# Altium project MiniPC.PrjPcb (part 6 of 10)

## Sheet PCIE_Connector.SchDoc: PCI Express GEN3  X 8 Connector
size B; DocumentNumber: 11; SheetNumber: 11; SheetTotal: 46
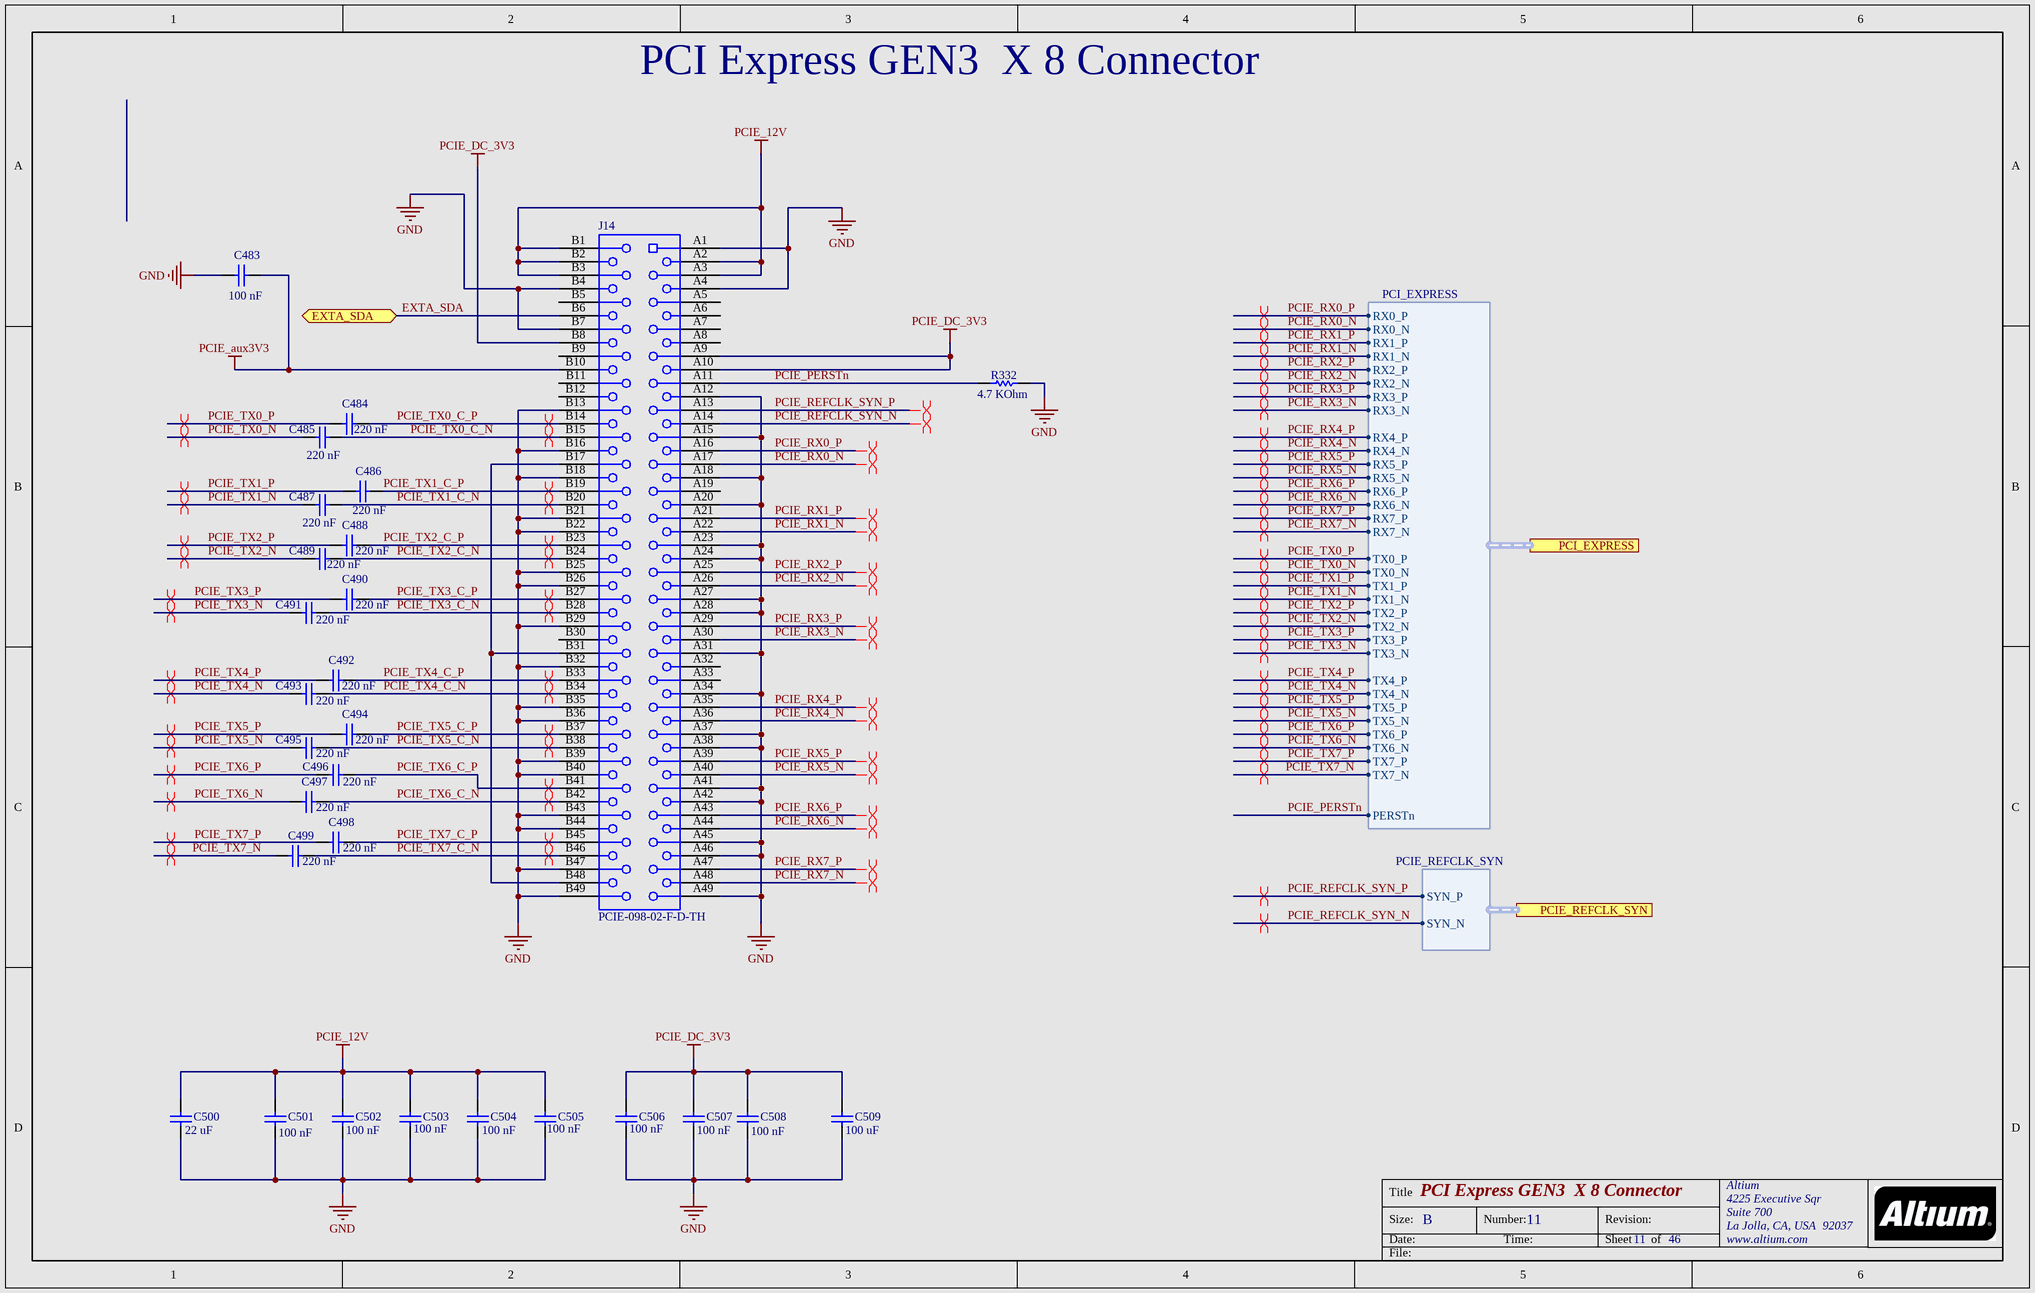
[diagram p18: PCIE_Connector.SchDoc]

### Parts
C483  Capacitance: 100 nF  [CAPC1005X55X10LL05]  (hidden comment: C1005X7R1E104M)
C484  Capacitance: 220 nF  [CAPC1005X55X25NL05T10]  (hidden comment: GRM155R61A224KE19D)
C485  Capacitance: 220 nF  [CAPC1005X55X25NL05T10]  (hidden comment: GRM155R61A224KE19D)
C486  Capacitance: 220 nF  [CAPC1005X55X25NL05T10]  (hidden comment: GRM155R61A224KE19D)
C487  Capacitance: 220 nF  [CAPC1005X55X25NL05T10]  (hidden comment: GRM155R61A224KE19D)
C488  Capacitance: 220 nF  [CAPC1005X55X25NL05T10]  (hidden comment: GRM155R61A224KE19D)
C489  Capacitance: 220 nF  [CAPC1005X55X25NL05T10]  (hidden comment: GRM155R61A224KE19D)
C490  Capacitance: 220 nF  [CAPC1005X55X25NL05T10]  (hidden comment: GRM155R61A224KE19D)
C491  Capacitance: 220 nF  [CAPC1005X55X25NL05T10]  (hidden comment: GRM155R61A224KE19D)
C492  Capacitance: 220 nF  [CAPC1005X55X25NL05T10]  (hidden comment: GRM155R61A224KE19D)
C493  Capacitance: 220 nF  [CAPC1005X55X25NL05T10]  (hidden comment: GRM155R61A224KE19D)
C494  Capacitance: 220 nF  [CAPC1005X55X25NL05T10]  (hidden comment: GRM155R61A224KE19D)
C495  Capacitance: 220 nF  [CAPC1005X55X25NL05T10]  (hidden comment: GRM155R61A224KE19D)
C496  Capacitance: 220 nF  [CAPC1005X55X25NL05T10]  (hidden comment: GRM155R61A224KE19D)
C497  Capacitance: 220 nF  [CAPC1005X55X25NL05T10]  (hidden comment: GRM155R61A224KE19D)
C498  Capacitance: 220 nF  [CAPC1005X55X25NL05T10]  (hidden comment: GRM155R61A224KE19D)
C499  Capacitance: 220 nF  [CAPC1005X55X25NL05T10]  (hidden comment: GRM155R61A224KE19D)
C500  Capacitance: 22 uF  [CAPC3216X180X55ML20T25]  (hidden comment: GRM31CR61E226KE15L)
C501  Capacitance: 100 nF  [CAPC1005X55X10LL05]  (hidden comment: C1005X7R1E104M)
C502  Capacitance: 100 nF  [CAPC1005X55X10LL05]  (hidden comment: C1005X7R1E104M)
C503  Capacitance: 100 nF  [CAPC1005X55X10LL05]  (hidden comment: C1005X7R1E104M)
C504  Capacitance: 100 nF  [CAPC1005X55X10LL05]  (hidden comment: C1005X7R1E104M)
C505  Capacitance: 100 nF  [CAPC1005X55X10LL05]  (hidden comment: C1005X7R1E104M)
C506  Capacitance: 100 nF  [CAPC1005X55X10LL05]  (hidden comment: C1005X7R1E104M)
C507  Capacitance: 100 nF  [CAPC1005X55X10LL05]  (hidden comment: C1005X7R1E104M)
C508  Capacitance: 100 nF  [CAPC1005X55X10LL05]  (hidden comment: C1005X7R1E104M)
C509  Capacitance: 100 uF  [CAPC3216X190X55ML30T25]  (hidden comment: GRM31CR60J107ME39L)
J14  PCIE-098-02-F-D-TH  [SMTC-PCIE-098-02-F-D-TH_V]
R332  Resistance: 4.7 KOhm  [RESC1005X40X25LL05T05]  (hidden comment: ERJ-2RKF4701X)

### Ports
EXTA_SDA (bidir), PCI_EXPRESS (harness PCI_EXPRESS), PCIE_REFCLK_SYN (harness PCIE_REFCLK_SYN)

### Harnesses
PCI_EXPRESS: RX0_P, RX0_N, RX1_P, RX1_N, RX2_P, RX2_N, RX3_P, RX3_N, RX7_N, RX7_P, RX4_P, RX4_N, RX5_P, RX5_N, RX6_P, RX6_N, TX0_P, TX0_N, TX1_P, TX1_N, TX2_P, TX2_N, TX3_P, TX3_N, TX7_N, TX7_P, TX4_P, TX4_N, TX5_P, TX5_N, TX6_P, TX6_N, PERSTn
PCIE_REFCLK_SYN: SYN_P, SYN_N

### Nets
GND: C483.1 C500.1 C501.1 C502.1 C503.1 C504.1 C505.1 C506.1 C507.1 C508.1 C509.1 J14.A1 J14.A4 J14.A12 J14.A15 J14.A18 J14.A20 J14.A23 J14.A24 J14.A27 J14.A28 J14.A31 J14.A34 J14.A37 J14.A38 J14.A41 J14.A42 J14.A45 J14.A46 J14.A49 J14.B4 J14.B7 J14.B13 J14.B16 J14.B18 J14.B21 J14.B22 J14.B25 J14.B26 J14.B29 J14.B32 J14.B35 J14.B36 J14.B39 J14.B40 J14.B43 J14.B44 J14.B47 J14.B49 R332.2
PCIE_12V: C500.2 C501.2 C502.2 C503.2 C504.2 C505.2 J14.A2 J14.A3 J14.B1 J14.B2 J14.B3
PCIE_aux3V3: C483.2 J14.B10
PCIE_DC_3V3: C506.2 C507.2 C508.2 C509.2 J14.A9 J14.A10 J14.B8
EXTA_SDA: J14.B6 ; port EXTA_SDA
PCIE_PERSTn: J14.A11 R332.1 ; port PCI_EXPRESS.PERSTn
PCIE_REFCLK_SYN_N: J14.A14 ; port PCIE_REFCLK_SYN.SYN_N
PCIE_REFCLK_SYN_P: J14.A13 ; port PCIE_REFCLK_SYN.SYN_P
PCIE_RX0_N: J14.A17 ; port PCI_EXPRESS.RX0_N
PCIE_RX0_P: J14.A16 ; port PCI_EXPRESS.RX0_P
PCIE_RX1_N: J14.A22 ; port PCI_EXPRESS.RX1_N
PCIE_RX1_P: J14.A21 ; port PCI_EXPRESS.RX1_P
PCIE_RX2_N: J14.A26 ; port PCI_EXPRESS.RX2_N
PCIE_RX2_P: J14.A25 ; port PCI_EXPRESS.RX2_P
PCIE_RX3_N: J14.A30 ; port PCI_EXPRESS.RX3_N
PCIE_RX3_P: J14.A29 ; port PCI_EXPRESS.RX3_P
PCIE_RX4_N: J14.A36 ; port PCI_EXPRESS.RX4_N
PCIE_RX4_P: J14.A35 ; port PCI_EXPRESS.RX4_P
PCIE_RX5_N: J14.A40 ; port PCI_EXPRESS.RX5_N
PCIE_RX5_P: J14.A39 ; port PCI_EXPRESS.RX5_P
PCIE_RX6_N: J14.A44 ; port PCI_EXPRESS.RX6_N
PCIE_RX6_P: J14.A43 ; port PCI_EXPRESS.RX6_P
PCIE_RX7_N: J14.A48 ; port PCI_EXPRESS.RX7_N
PCIE_RX7_P: J14.A47 ; port PCI_EXPRESS.RX7_P
PCIE_TX0_C_N: C485.2 J14.B15
PCIE_TX0_C_P: C484.2 J14.B14
PCIE_TX0_N: C485.1 ; port PCI_EXPRESS.TX0_N
PCIE_TX0_P: C484.1 ; port PCI_EXPRESS.TX0_P
PCIE_TX1_C_N: C487.2 J14.B20
PCIE_TX1_C_P: C486.2 J14.B19
PCIE_TX1_N: C487.1 ; port PCI_EXPRESS.TX1_N
PCIE_TX1_P: C486.1 ; port PCI_EXPRESS.TX1_P
PCIE_TX2_C_N: C489.2 J14.B24
PCIE_TX2_C_P: C488.2 J14.B23
PCIE_TX2_N: C489.1 ; port PCI_EXPRESS.TX2_N
PCIE_TX2_P: C488.1 ; port PCI_EXPRESS.TX2_P
PCIE_TX3_C_N: C491.2 J14.B28
PCIE_TX3_C_P: C490.2 J14.B27
PCIE_TX3_N: C491.1 ; port PCI_EXPRESS.TX3_N
PCIE_TX3_P: C490.1 ; port PCI_EXPRESS.TX3_P
PCIE_TX4_C_N: C493.2 J14.B34
PCIE_TX4_C_P: C492.2 J14.B33
PCIE_TX4_N: C493.1 ; port PCI_EXPRESS.TX4_N
PCIE_TX4_P: C492.1 ; port PCI_EXPRESS.TX4_P
PCIE_TX5_C_N: C495.2 J14.B38
PCIE_TX5_C_P: C494.2 J14.B37
PCIE_TX5_N: C495.1 ; port PCI_EXPRESS.TX5_N
PCIE_TX5_P: C494.1 ; port PCI_EXPRESS.TX5_P
PCIE_TX6_C_N: C497.2 J14.B42
PCIE_TX6_C_P: C496.2 J14.B41
PCIE_TX6_N: C497.1 ; port PCI_EXPRESS.TX6_N
PCIE_TX6_P: C496.1 ; port PCI_EXPRESS.TX6_P
PCIE_TX7_C_N: C499.2 J14.B46
PCIE_TX7_C_P: C498.2 J14.B45
PCIE_TX7_N: C499.1 ; port PCI_EXPRESS.TX7_N
PCIE_TX7_P: C498.1 ; port PCI_EXPRESS.TX7_P
NetJ14_B17: J14.B17 J14.B31 J14.B48

Not connected (* = marked no-connect by the designer): J14 A5 A6 A7 A8 A19 A32 A33 B5 B9 B11 B12 B30

### Layout directives
differential pair: PCIE_REFCLK_SYN_N, PCIE_REFCLK_SYN_P, PCIE_RX0_N, PCIE_RX0_P, PCIE_RX1_N, PCIE_RX1_P, PCIE_RX2_N, PCIE_RX2_P, PCIE_RX3_N, PCIE_RX3_P, PCIE_RX4_N, PCIE_RX4_P, PCIE_RX5_N, PCIE_RX5_P, PCIE_RX6_N, PCIE_RX6_P, PCIE_RX7_N, PCIE_RX7_P, PCIE_TX0_C_N, PCIE_TX0_C_P, PCIE_TX0_N, PCIE_TX0_P, PCIE_TX1_C_N, PCIE_TX1_C_P, PCIE_TX1_N, PCIE_TX1_P, PCIE_TX2_C_N, PCIE_TX2_C_P, PCIE_TX2_N, PCIE_TX2_P, PCIE_TX3_C_N, PCIE_TX3_C_P, PCIE_TX3_N, PCIE_TX3_P, PCIE_TX4_C_N, PCIE_TX4_C_P, PCIE_TX4_N, PCIE_TX4_P, PCIE_TX5_C_N, PCIE_TX5_C_P, PCIE_TX5_N, PCIE_TX5_P, PCIE_TX6_C_N, PCIE_TX6_C_P, PCIE_TX6_N, PCIE_TX6_P, PCIE_TX7_C_N, PCIE_TX7_C_P, PCIE_TX7_N, PCIE_TX7_P

### Notes on the sheet
- Title
- Size:
- Date:
- B
- Number:
- Time:
- Revision:
- Sheet
- of
- File:

### Library data of the parts
C483 C501-C508 = CMP-1663-00009-2: Chip Capacitor, 0.1 uF, +/- 20%, 25 V, -55 to 125 degC, 0402 (1005 Metric), RoHS, Tape and Reel; Type (Capacitors): X7R; Voltage Rating: 25 V; Case\/Package: 0402; Tolerance: 20%; Max Operating Temperature: 125 degC; ComponentLink2URL: http://www.farnell.com/datasheets/1571323.pdf; ComponentLink1URL: http://www.tdk.com/; RoHSCompliant: true; Packaging: Tape and Reel; Mounting Technology: Surface Mount; ComponentLink2Description: Datasheet; Case Code (Imperial): 0402; DatasheetVersion: 09/2011; ComponentLink1Description: Manufacturer URL; PackageDescription: 2-Pin Surface Mount Device, Body 1 x 0.5 mm; PackageReference: 0402; Min Operating Temperature: -55 degC; Case Code (Metric): 1005; Height: 0.5 mm; Package Quantity: 10000; Width: 0.5 mm; Pins: 2; Voltage Rating (DC): 25 V; PartNumber: C1005X7R1E104M; Mount: Surface Mount; Length: 1 mm
C484-C499 = CMP-2008-04561-4: Chip Capacitor, 220 nF, +/- 10%, 10 V, -55 to 85 degC, 0402 (1005 Metric), RoHS, Tape and Reel; Manufacturer: Basic Passives; Voltage Rating: 10 V; Case\/Package: 0402; Type (Capacitors): X5R; ComponentLink1URL: http://www.murata.com/; Package Quantity: 1; Tolerance: 10%; Mounting Technology: Surface Mount; RoHSCompliant: true; PartNumber: GRM155R61A224KE19D; Max Operating Temperature: 85 degC; Case Code (Imperial): 0402; Length: 1 mm; Packaging: Tape and Reel; Min Operating Temperature: -55 degC; PackageDescription: 2-Pin Surface Mount Device, Body 1 x 0.5 mm; Height: 0.5 mm; Case Code (Metric): 1005; REACH SVHC: No SVHC; ComponentLink1Description: Manufacturer URL; Width: 0.5 mm; ComponentLink2URL: http://search.murata.co.jp/Ceramy/image/img/A01X/G101/ENG/GRM155R61A224KE19-01.pdf; Radiation Hardening: No; Pins: 2; Voltage Rating (DC): 10 V; DatasheetVersion: 03/2016; Mount: Surface Mount; PackageReference: 0402; ComponentLink2Description: Datasheet
C500 = CMP-1662-00010-2: Chip Capacitor, 22 uF, +/- 10%, 25 V, -55 to 85 degC, 1206 (3216 Metric), RoHS, Tape and Reel; Voltage Rating (DC): 25 V; Case\/Package: 1206; Type (Capacitors): X5R; Tolerance: 10%; Max Operating Temperature: 85 degC; Package Quantity: 2000; Voltage Rating: 25 V; Case Code (Metric): 3216; Length: 3.2 mm; PackageDescription: 2-Pin Surface Mount Device, Body 3.2 x 1.6 mm; ComponentLink1Description: Manufacturer URL; Case Code (Imperial): 1206; ComponentLink1URL: http://www.murata.com/; Radiation Hardening: No; Height: 1.6 mm; Width: 1.6 mm; DatasheetVersion: 03/2016; Min Operating Temperature: -55 degC; Mount: Surface Mount; REACH SVHC: No SVHC; PackageReference: 1206; ComponentLink2URL: http://search.murata.co.jp/Ceramy/image/img/A01X/G101/ENG/GRM31CR61E226KE15-01.pdf; Packaging: Tape and Reel; RoHSCompliant: true; ComponentLink2Description: Datasheet; Mounting Technology: Surface Mount; PartNumber: GRM31CR61E226KE15L; Pins: 2
C509 = CMP-1662-00011-2: Chip Capacitor, 100 uF, +/- 20%, 6.3 V, -55 to 85 degC, 1206 (3216 Metric), RoHS, Tape and Reel; Voltage Rating: 6.3 V; Type (Capacitors): X5R; Case\/Package: 1206; Tolerance: 20%; ComponentLink1URL: http://www.murata.com/; ComponentLink1Description: Manufacturer URL; PackageDescription: 2-Pin Surface Mount Device, Body 3.2 x 1.6 mm; Max Operating Temperature: 85 degC; Case Code (Imperial): 1206; PackageReference: 1206; Height: 1.6 mm; Width: 1.6 mm; Packaging: Tape and Reel; DatasheetVersion: 09/2016; REACH SVHC: No SVHC; Mounting Technology: Surface Mount; Case Code (Metric): 3216; Min Operating Temperature: -55 degC; RoHSCompliant: true; Radiation Hardening: No; Voltage Rating (DC): 6.3 V; Package Quantity: 2000; ComponentLink2Description: Datasheet; Mount: Surface Mount; Length: 3.2 mm; ComponentLink2URL: http://psearch.en.murata.com/capacitor/product/GRM31CR60J107ME39%23.pdf; Pins: 2; PartNumber: GRM31CR60J107ME39L
J14 = CMP-1707-00002-1: Female Header, Pitch 1 mm, 98 Positions, 4 Rows, Height 11 mm, Tail Length 2.31 mm, -55 to 125 degC, RoHS; Manufacturer: Samtec; PartNumber: PCIE-098-02-F-D-TH; PackageReference: PCIE-098-02-F-D-TH; ComponentLink3URL: http://suddendocs.samtec.com/prints/pcie-xxx-02-x-d-th-footprint.pdf; PackageDescription: Female Header, Pitch 1 mm, 98 Positions, 4 Rows, Height 11 mm, Tail Length 2.31 mm; ComponentLink2Description: Datasheet; ComponentLink1URL: http://www.samtec.com/; Mounting Technology: Through Hole; DatasheetVersion: Rev. 21JAN16; ComponentLink2URL: http://suddendocs.samtec.com/catalog_english/pcie.pdf; ComponentLink1Description: Manufacturer URL; ComponentLink3Description: Package Specification
R332 = CMP-1665-00031-3: Chip Resistor, 4.7 KOhm, +/- 1%, 0.1 W, -55 to 155 degC, 0402 (1005 Metric), RoHS, Tape and Reel; Voltage Rating: 50 V; Case\/Package: 0402; Power Rating: 100 mW; Tolerance: 1%; Case Code (Imperial): 0402; PartNumber: ERJ-2RKF4701X; Mounting Technology: Surface Mount; ComponentLink1Description: Manufacturer URL; Width: 0.5 mm; DatasheetVersion: 04/2015; PackageDescription: 2-Pin Surface Mount Device, Body 1 x 0.5 mm; ComponentLink2Description: Datasheet; Packaging: Cut Tape; RoHSCompliant: true; Package Quantity: 1; Height: 0.35 mm; REACH SVHC: Yes; Case Code (Metric): 1005; Max Operating Temperature: 155 degC; ComponentLink1URL: http://www.panasonic.com/; Radiation Hardening: No; ComponentLink2URL: http://industrial.panasonic.com/cdbs/www-data/pdf/RDA0000/AOA0000C86.pdf; Min Operating Temperature: -55 degC; Length: 1 mm; Pins: 2; PackageReference: 0402; Mount: Surface Mount

## Sheet PLL1.SchDoc: PLL
size B; DocumentNumber: 13; SheetNumber: 13; SheetTotal: 46
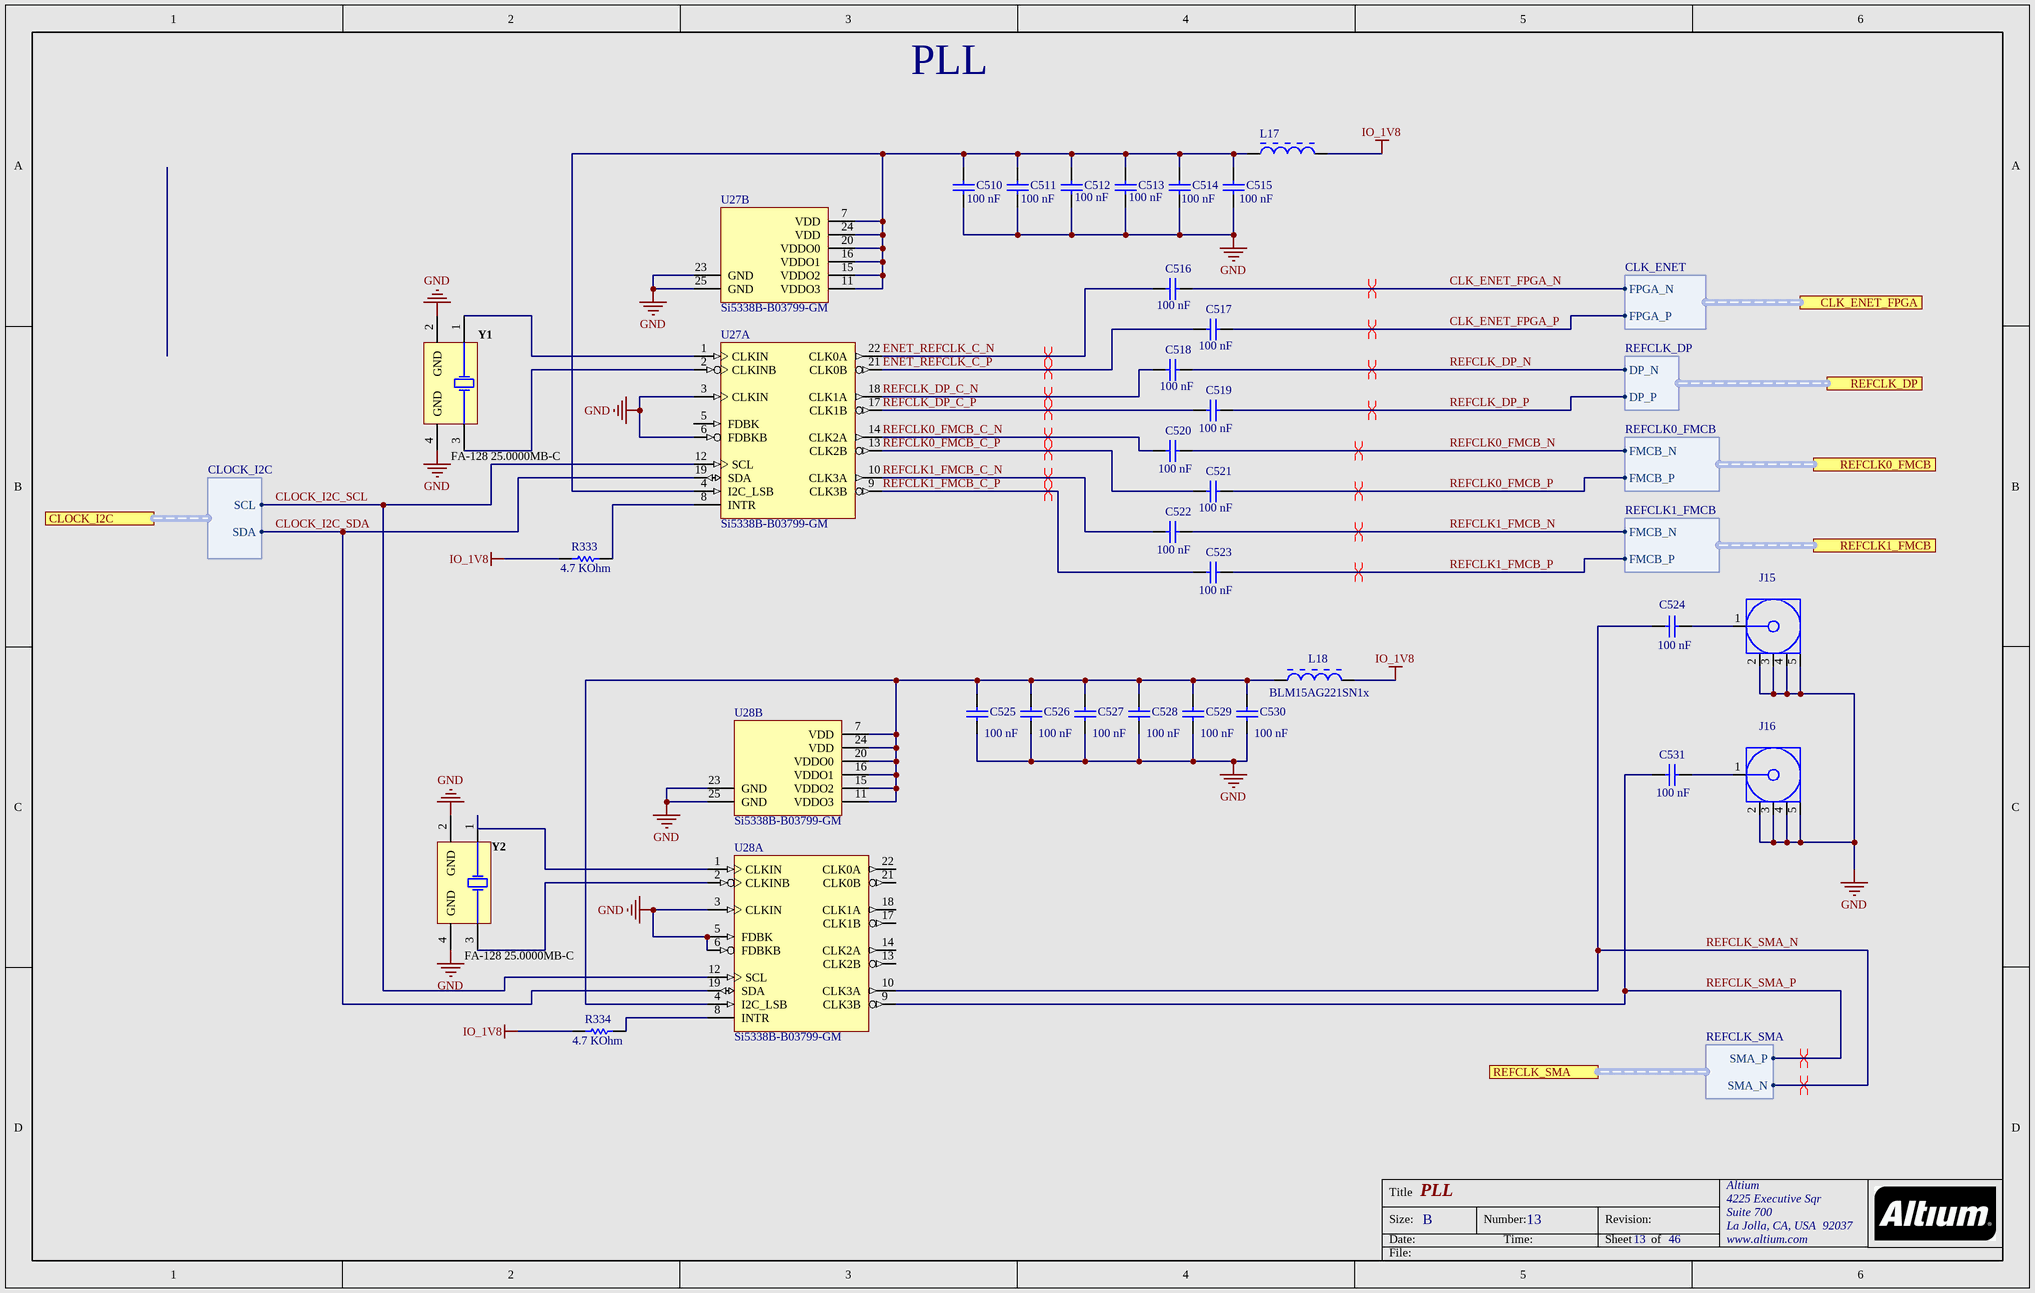
[diagram p19: PLL1.SchDoc]

### Parts
C510  Capacitance: 100 nF  [CAPC1005X55X10LL05]  (hidden comment: C1005X7R1E104M)
C511  Capacitance: 100 nF  [CAPC1005X55X10LL05]  (hidden comment: C1005X7R1E104M)
C512  Capacitance: 100 nF  [CAPC1005X55X10LL05]  (hidden comment: C1005X7R1E104M)
C513  Capacitance: 100 nF  [CAPC1005X55X10LL05]  (hidden comment: C1005X7R1E104M)
C514  Capacitance: 100 nF  [CAPC1005X55X10LL05]  (hidden comment: C1005X7R1E104M)
C515  Capacitance: 100 nF  [CAPC1005X55X10LL05]  (hidden comment: C1005X7R1E104M)
C516  Capacitance: 100 nF  [CAPC1005X55X10LL05]  (hidden comment: C1005X7R1E104M)
C517  Capacitance: 100 nF  [CAPC1005X55X10LL05]  (hidden comment: C1005X7R1E104M)
C518  Capacitance: 100 nF  [CAPC1005X55X10LL05]  (hidden comment: C1005X7R1E104M)
C519  Capacitance: 100 nF  [CAPC1005X55X10LL05]  (hidden comment: C1005X7R1E104M)
C520  Capacitance: 100 nF  [CAPC1005X55X10LL05]  (hidden comment: C1005X7R1E104M)
C521  Capacitance: 100 nF  [CAPC1005X55X10LL05]  (hidden comment: C1005X7R1E104M)
C522  Capacitance: 100 nF  [CAPC1005X55X10LL05]  (hidden comment: C1005X7R1E104M)
C523  Capacitance: 100 nF  [CAPC1005X55X10LL05]  (hidden comment: C1005X7R1E104M)
C524  Capacitance: 100 nF  [CAPC1005X55X10LL05]  (hidden comment: C1005X7R1E104M)
C525  Capacitance: 100 nF  [CAPC1005X55X10LL05]  (hidden comment: C1005X7R1E104M)
C526  Capacitance: 100 nF  [CAPC1005X55X10LL05]  (hidden comment: C1005X7R1E104M)
C527  Capacitance: 100 nF  [CAPC1005X55X10LL05]  (hidden comment: C1005X7R1E104M)
C528  Capacitance: 100 nF  [CAPC1005X55X10LL05]  (hidden comment: C1005X7R1E104M)
C529  Capacitance: 100 nF  [CAPC1005X55X10LL05]  (hidden comment: C1005X7R1E104M)
C530  Capacitance: 100 nF  [CAPC1005X55X10LL05]  (hidden comment: C1005X7R1E104M)
C531  Capacitance: 100 nF  [CAPC1005X55X10LL05]  (hidden comment: C1005X7R1E104M)
J15  LTI-SASF54GT  [LHT-LTI-SASF54GT_V]  (value not drawn)
J16  LTI-SASF54GT  [LHT-LTI-SASF54GT_V]  (value not drawn)
L17  BLM15AG221SN1J  [MURA-BLM15-CHIP-2_V]  (value not drawn)
L18  BLM15AG221SN1x  [MURA-BLM15AG221SN1x_V]
R333  Resistance: 4.7 KOhm  [RESC1005X40X25LL05T05]  (hidden comment: ERJ-2RKF4701X)
R334  Resistance: 4.7 KOhm  [RESC1005X40X25LL05T05]  (hidden comment: ERJ-2RKF4701X)
U27  Si5338B-B03799-GM  [SLAB-QFN-24-2550x2550TP_V]  (parts A,B of 2)
U28  Si5338B-B03799-GM  [SLAB-QFN-24-2550x2550TP_V]  (parts A,B of 2)
Y1  FA-128 25.0000MB-C  [EPSON-FA-128_V]
Y2  FA-128 25.0000MB-C  [EPSON-FA-128_V]

### Ports
CLK_ENET_FPGA (harness CLK_ENET), CLOCK_I2C (harness CLOCK_I2C), REFCLK0_FMCB (harness REFCLK0_FMCB), REFCLK1_FMCB (harness REFCLK1_FMCB), REFCLK_DP (harness REFCLK_DP), REFCLK_SMA (harness REFCLK_SMA)

### Harnesses
REFCLK0_FMCB: FMCB_N, FMCB_P
CLK_ENET: FPGA_N, FPGA_P
REFCLK1_FMCB: FMCB_N, FMCB_P
REFCLK_SMA: SMA_P, SMA_N
REFCLK_DP: DP_N, DP_P
CLOCK_I2C: SCL, SDA

### Nets
GND: C510.2 C511.2 C512.2 C513.2 C514.2 C515.2 C525.2 C526.2 C527.2 C528.2 C529.2 C530.2 J15.2 J15.3 J15.4 J15.5 J16.2 J16.3 J16.4 J16.5 U27.3(CLKIN) U27.6(FDBKB) U27.23(GND) U27.25(GND) U28.3(CLKIN) U28.5(FDBK) U28.6(FDBKB) U28.23(GND) U28.25(GND) Y1.2(GND) Y1.4(GND) Y2.2(GND) Y2.4(GND)
IO_1V8: L17.2 L18.2 R333.1 R334.1
CLK_ENET_FPGA_N: C516.2 ; port CLK_ENET_FPGA.FPGA_N
CLK_ENET_FPGA_P: C517.2 ; port CLK_ENET_FPGA.FPGA_P
CLOCK_I2C_SCL: U27.12(SCL) U28.12(SCL) ; port CLOCK_I2C.SCL
CLOCK_I2C_SDA: U27.19(SDA) U28.19(SDA) ; port CLOCK_I2C.SDA
ENET_REFCLK_C_N: C516.1 U27.22(CLK0A)
ENET_REFCLK_C_P: C517.1 U27.21(CLK0B)
REFCLK0_FMCB_C_N: C520.1 U27.14(CLK2A)
REFCLK0_FMCB_C_P: C521.1 U27.13(CLK2B)
REFCLK0_FMCB_N: C520.2 ; port REFCLK0_FMCB.FMCB_N
REFCLK0_FMCB_P: C521.2 ; port REFCLK0_FMCB.FMCB_P
REFCLK1_FMCB_C_N: C522.1 U27.10(CLK3A)
REFCLK1_FMCB_C_P: C523.1 U27.9(CLK3B)
REFCLK1_FMCB_N: C522.2 ; port REFCLK1_FMCB.FMCB_N
REFCLK1_FMCB_P: C523.2 ; port REFCLK1_FMCB.FMCB_P
REFCLK_DP_C_N: C518.1 U27.18(CLK1A)
REFCLK_DP_C_P: C519.1 U27.17(CLK1B)
REFCLK_DP_N: C518.2 ; port REFCLK_DP.DP_N
REFCLK_DP_P: C519.2 ; port REFCLK_DP.DP_P
REFCLK_SMA_N: C524.1 U28.10(CLK3A) ; port REFCLK_SMA.SMA_N
REFCLK_SMA_P: C531.1 U28.9(CLK3B) ; port REFCLK_SMA.SMA_P
NetC510_1: C510.1 C511.1 C512.1 C513.1 C514.1 C515.1 L17.1 U27.4(I2C_LSB) U27.7(VDD) U27.11(VDDO3) U27.15(VDDO2) U27.16(VDDO1) U27.20(VDDO0) U27.24(VDD)
NetC524_2: C524.2 J15.1
NetC525_1: C525.1 C526.1 C527.1 C528.1 C529.1 C530.1 L18.1 U28.4(I2C_LSB) U28.7(VDD) U28.11(VDDO3) U28.15(VDDO2) U28.16(VDDO1) U28.20(VDDO0) U28.24(VDD)
NetC531_2: C531.2 J16.1
NetR333_2: R333.2 U27.8(INTR)
NetR334_2: R334.2 U28.8(INTR)
NetU27_1: U27.1(CLKIN) Y1.1(X1)
NetU27_2: U27.2(CLKINB) Y1.3(X2)
NetU28_1: U28.1(CLKIN) Y2.1(X1)
NetU28_2: U28.2(CLKINB) Y2.3(X2)

Not connected (* = marked no-connect by the designer): U27 5(FDBK); U28 13(CLK2B) 14(CLK2A) 17(CLK1B) 18(CLK1A) 21(CLK0B) 22(CLK0A)

### Layout directives
differential pair: CLK_ENET_FPGA_N, CLK_ENET_FPGA_P, ENET_REFCLK_C_N, ENET_REFCLK_C_P, REFCLK0_FMCB_C_N, REFCLK0_FMCB_C_P, REFCLK0_FMCB_N, REFCLK0_FMCB_P, REFCLK1_FMCB_C_N, REFCLK1_FMCB_C_P, REFCLK1_FMCB_N, REFCLK1_FMCB_P, REFCLK_DP_C_N, REFCLK_DP_C_P, REFCLK_DP_N, REFCLK_DP_P, REFCLK_SMA_N, REFCLK_SMA_P

### Notes on the sheet
- Title
- Size:
- Date:
- B
- Number:
- Time:
- Revision:
- Sheet
- of
- File:

### Library data of the parts
C510-C531 = CMP-1663-00009-2: as C483 on sheet PCIE_Connector; Tolerance: 20%; Mounting Technology: Surface Mount; Max Operating Temperature: 125 degC; ComponentLink2URL: http://www.farnell.com/datasheets/1571323.pdf; ComponentLink1URL: http://www.tdk.com/; RoHSCompliant: true; Packaging: Tape and Reel; ComponentLink2Description: Datasheet; Case Code (Imperial): 0402; DatasheetVersion: 09/2011; ComponentLink1Description: Manufacturer URL; PackageDescription: 2-Pin Surface Mount Device, Body 1 x 0.5 mm; PackageReference: 0402; Min Operating Temperature: -55 degC; Case Code (Metric): 1005; Height: 0.5 mm; Package Quantity: 10000; Width: 0.5 mm; Pins: 2; Voltage Rating (DC): 25 V; PartNumber: C1005X7R1E104M; Mount: Surface Mount; Length: 1 mm
J15 J16 = CMP-1713-00001-1: SMA Connector, Pitch 2.54 mm, 1 Position, Height 9.5 mm, Tail Length 4 mm, RoHS; Manufacturer: Lighthorse Technologies Inc.; ComponentLink2Description: Datasheet; Mounting Technology: Through Hole; ComponentLink1Description: Manufacturer URL; PackageDescription: SMA Connector, Pitch 2.54 mm, 1 Position, Height 9.5 mm, Tail Length 4 mm; PartNumber: LTI-SASF54GT; PackageReference: LTI-SASF54GT; DatasheetVersion: Rev. May-99; ComponentLink2URL: http://rfconnector.com/sheets/SASF54GT.pdf; ComponentLink1URL: http://www.rfconnector.com
L17 = CMP-0686-00186-2: Chip Ferrite Bead for General Use, 220 Ohm, 450 mA, -55 to 125 degC, 1 x 0.5 x 0.55 mm SMD, Tape and Reel; Manufacturer: Murata; DC Resistance: 0.29 Ohm Max.; Rated Current: 450 mA; Impedance (at 100 MHz): 220 Ohm +/- 25%; DatasheetVersion: 08/2013; ComponentLink2URL: http://www.murata.com/products/catalog/pdf/c31e.pdf; PackageDescription: 2-Pin Chip, Body 1 x 0.5 mm; ComponentLink3Description: Package Specification; Packing: Tape and Reel; Operating Temperature Range: -55 to 125 degC; ComponentLink3URL: http://www.murata.com/products/catalog/pdf/c31e.pdf; Mounting Technology: Surface Mount; PartNumber: BLM15AG221SN1J; ComponentLink2Description: Datasheet; ComponentLink1Description: Manufacturer URL; PackageReference: BLM15-2; ComponentLink1URL: http://www.murata.com/
L18 = CMP-1662-00018-3: Chip Bead, 220 Ohm, +/- 25 %, 100 MHz, 300 mA, -55 to 125 degC, 0402 (1005 Metric), RoHS; Current Rating: 200 mA; Max Current Rating: 450 mA; Resistance: 220 Ohm; Tolerance: 25%; PartNumber: BLM15AG221SN1x; ComponentLink1Description: Manufacturer URL; Max Operating Temperature: 125 degC; Length: 1 mm; Width: 0.5 mm; REACH SVHC: No SVHC; Height: 0.5 mm; DatasheetVersion: 03/2011; Case/Package: 0402; ComponentLink2URL: https://datasheet.ciiva.com/11800/0900766b811b5866-11800858.pdf; Min Operating Temperature: -55 degC; RoHSCompliant: True; Radiation Hardening: No; Package Quantity: 10000; Case Code (Imperial): 0402; ComponentLink1URL: http://www.murata.com/; ComponentLink2Description: Datasheet; Mounting Technology: Surface Mount; PackageDescription: 2-Pin Surface Mount Device, Body 1 x 0.5 mm; Case Code (Metric): 1005
R333 R334 = CMP-1665-00031-3: as R332 on sheet PCIE_Connector; Tolerance: 1%; Case Code (Imperial): 0402; PartNumber: ERJ-2RKF4701X; Mounting Technology: Surface Mount; ComponentLink1Description: Manufacturer URL; Width: 0.5 mm; DatasheetVersion: 04/2015; PackageDescription: 2-Pin Surface Mount Device, Body 1 x 0.5 mm; ComponentLink2Description: Datasheet; Packaging: Cut Tape; RoHSCompliant: true; Package Quantity: 1; Height: 0.35 mm; REACH SVHC: Yes; Case Code (Metric): 1005; Max Operating Temperature: 155 degC; ComponentLink1URL: http://www.panasonic.com/; Radiation Hardening: No; ComponentLink2URL: http://industrial.panasonic.com/cdbs/www-data/pdf/RDA0000/AOA0000C86.pdf; Min Operating Temperature: -55 degC; Length: 1 mm; Pins: 2; PackageReference: 0402; Mount: Surface Mount
U27 U28 = CMP-1706-00002-1: I2C-Programmable Any-Frequency, Any-Output Quad Clock Generator, 1.8 / 2.5 / 3.3 V, 0.16 to 350 MHz Output, -40 to 85 degC, 24-Pin QFN, RoHS; Manufacturer: Silicon Labs; PartNumber: Si5338B-B03799-GM; ComponentLink1Description: Manufacturer URL; ComponentLink2Description: Datasheet; ComponentLink2URL: https://www.silabs.com/Support%20Documents/TechnicalDocs/Si5338.pdf; Mounting Technology: Surface Mount; DatasheetVersion: Rev. 1.6; PackageDescription: 24-Pin Quad Flat No-lead Package, Body 4 x 4 mm, Pitch 0.5 mm; ComponentLink1URL: http://www.silabs.com/; PackageReference: QFN-24; Code_IPC: J-STD-020; PartId: 1
Y1 Y2 = CMP-1695-00001-3: Range Crystal Unit, 25 MHz, -40 to 85 degC, 4-Pin SMD, RoHS, Tape and Reel; ComponentLink2Description: Datasheet; Mounting Technology: Surface Mount; PackageDescription: 4-Pin Surface Mount Device, Body 1.6 x 2 mm, Pitch 1.45 mm; ComponentLink1URL: https://www.eea.epson.com/; DatasheetVersion: Rev. Feb-15; ComponentLink2URL: https://support.epson.biz/td/api/doc_check.php?dl=brief_FA-128_en.pdf; ComponentLink1Description: Manufacturer URL; PartNumber: FA-128 25.0000MB-C

## Sheet PLL.SchDoc: PLL
size B; DocumentNumber: 12; SheetNumber: 12; SheetTotal: 46
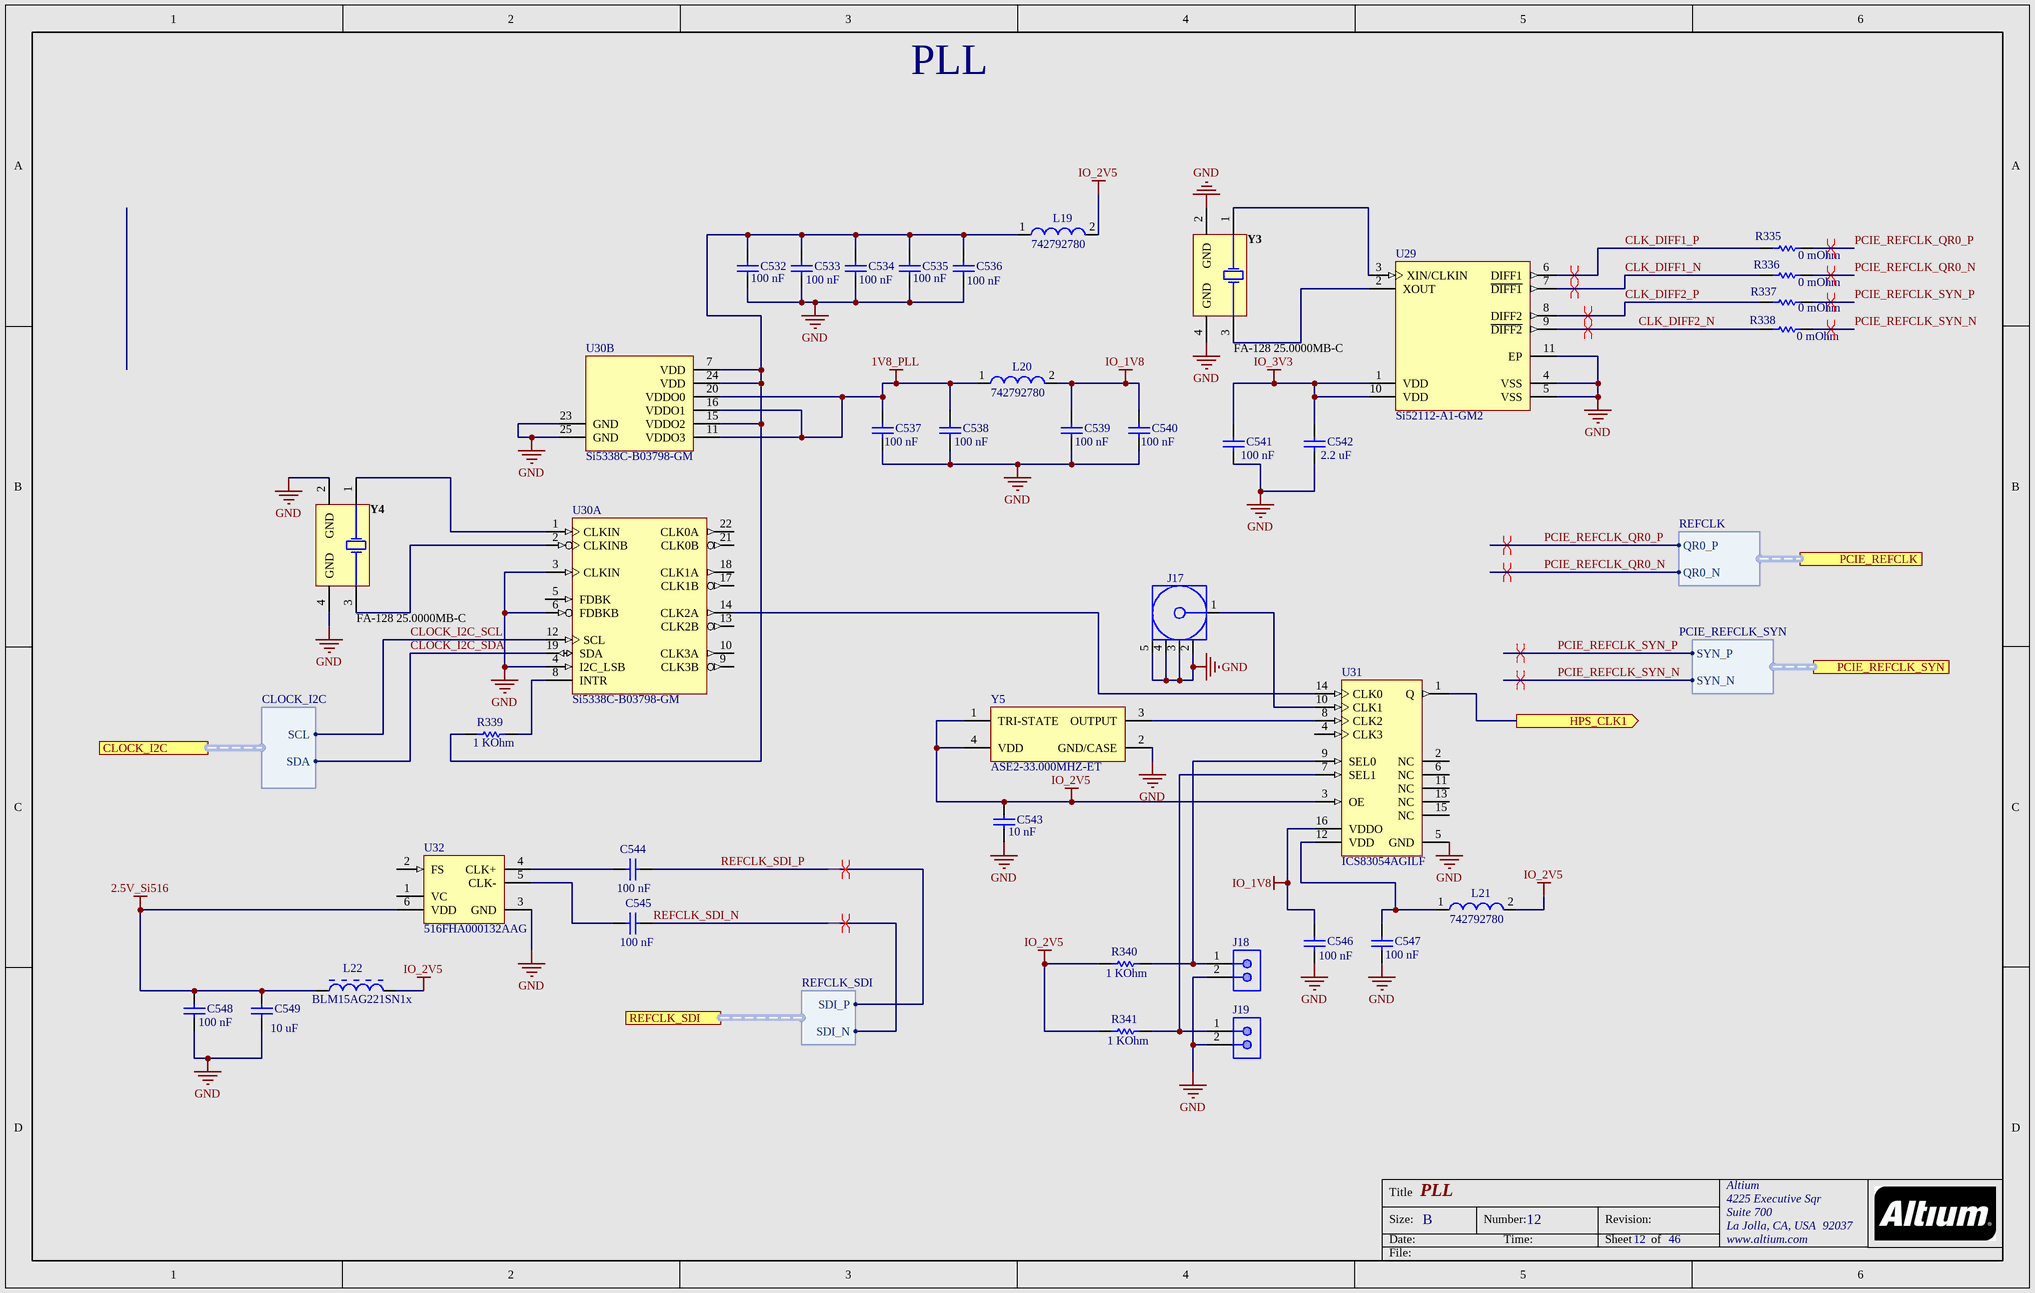
[diagram p20: PLL.SchDoc]

### Parts
C532  Capacitance: 100 nF  [CAPC1005X55X10LL05]  (hidden comment: C1005X7R1E104M)
C533  Capacitance: 100 nF  [CAPC1005X55X10LL05]  (hidden comment: C1005X7R1E104M)
C534  Capacitance: 100 nF  [CAPC1005X55X10LL05]  (hidden comment: C1005X7R1E104M)
C535  Capacitance: 100 nF  [CAPC1005X55X10LL05]  (hidden comment: C1005X7R1E104M)
C536  Capacitance: 100 nF  [CAPC1005X55X10LL05]  (hidden comment: C1005X7R1E104M)
C537  Capacitance: 100 nF  [CAPC1005X55X10LL05]  (hidden comment: C1005X7R1E104M)
C538  Capacitance: 100 nF  [CAPC1005X55X10LL05]  (hidden comment: C1005X7R1E104M)
C539  Capacitance: 100 nF  [CAPC1005X55X10LL05]  (hidden comment: C1005X7R1E104M)
C540  Capacitance: 100 nF  [CAPC1005X55X10LL05]  (hidden comment: C1005X7R1E104M)
C541  Capacitance: 100 nF  [CAPC1005X55X10LL05]  (hidden comment: C1005X7R1E104M)
C542  Capacitance: 2.2 uF  [CAPC1608X90X35ML10T15]  (hidden comment: GRM188R61A225KE34x)
C543  Capacitance: 10 nF  [CAPC1005X55X25ML05T10]  (hidden comment: GRM155R71H103KA88D)
C544  Capacitance: 100 nF  [CAPC1005X55X10LL05]  (hidden comment: C1005X7R1E104M)
C545  Capacitance: 100 nF  [CAPC1005X55X10LL05]  (hidden comment: C1005X7R1E104M)
C546  Capacitance: 100 nF  [CAPC1005X55X10LL05]  (hidden comment: C1005X7R1E104M)
C547  Capacitance: 100 nF  [CAPC1005X55X10LL05]  (hidden comment: C1005X7R1E104M)
C548  Capacitance: 100 nF  [CAPC1005X55X10LL05]  (hidden comment: C1005X7R1E104M)
C549  Capacitance: 10 uF  [CAPC2013X100X20NL20]  (hidden comment: C2012X5R1C106K085AC)
J17  LTI-SASF54GT  [LHT-LTI-SASF54GT_V]  (value not drawn)
J18  613 002 111 21  [WE-61300211121_V]  (value not drawn)
J19  613 002 111 21  [WE-61300211121_V]  (value not drawn)
L19  742792780  [SMD-0402]
L20  742792780  [SMD-0402]
L21  742792780  [SMD-0402]
L22  BLM15AG221SN1x  [MURA-BLM15AG221SN1x_V]
R335  Resistance: 0 mOhm  [RESC1005X40X25ML05T05]  (hidden comment: ERJ-2GE0R00X)
R336  Resistance: 0 mOhm  [RESC1005X40X25ML05T05]  (hidden comment: ERJ-2GE0R00X)
R337  Resistance: 0 mOhm  [RESC1005X40X25ML05T05]  (hidden comment: ERJ-2GE0R00X)
R338  Resistance: 0 mOhm  [RESC1005X40X25ML05T05]  (hidden comment: ERJ-2GE0R00X)
R339  Resistance: 1 KOhm  [RESC1005X40X25LL05T05]  (hidden comment: ERJ-2RKF1001X)
R340  Resistance: 1 KOhm  [RESC1005X40X25LL05T05]  (hidden comment: ERJ-2RKF1001X)
R341  Resistance: 1 KOhm  [RESC1005X40X25LL05T05]  (hidden comment: ERJ-2RKF1001X)
U29  Si52112-A1-GM2  [SLAB-TDFN-10_L]
U30  Si5338C-B03798-GM  [SLAB-QFN-24-2550x2550TP_V]  (parts A,B of 2)
U31  ICS83054AGILF  [IDT-TSSOP-16_M]
U32  516FHA000132AAG  [SLAB-DFN-6-5000X7000DE_A_V]
Y3  FA-128 25.0000MB-C  [EPSON-FA-128_V]
Y4  FA-128 25.0000MB-C  [EPSON-FA-128_V]
Y5  ASE2-33.000MHZ-ET  [ABRA-ASE2_V]

### Ports
CLOCK_I2C (harness CLOCK_I2C), HPS_CLK1 (out), PCIE_REFCLK (harness REFCLK), PCIE_REFCLK_SYN (harness PCIE_REFCLK_SYN), REFCLK_SDI (harness REFCLK_SDI)

### Harnesses
REFCLK: QR0_P, QR0_N
PCIE_REFCLK_SYN: SYN_N, SYN_P
REFCLK_SDI: SDI_P, SDI_N
CLOCK_I2C: SCL, SDA

### Nets
1V8_PLL: C537.2 C538.2 L20.1 U30.11(VDDO3) U30.16(VDDO1) U30.20(VDDO0)
2.5V_Si516: C548.2 C549.2 L22.1 U32.6(VDD)
GND: C532.1 C533.1 C534.1 C535.1 C536.1 C537.1 C538.1 C539.1 C540.1 C541.1 C542.1 C543.1 C546.1 C547.1 C548.1 C549.1 J17.2 J17.3 J17.4 J17.5 J18.2 J19.2 U29.4(VSS) U29.5(VSS) U29.11(EP) U30.3(CLKIN) U30.4(I2C_LSB) U30.6(FDBKB) U30.23(GND) U30.25(GND) U31.5(GND) U32.3(GND) Y3.2(GND) Y3.4(GND) Y4.2(GND) Y4.4(GND) Y5.2(GND/CASE)
IO_1V8: C539.2 C540.2 C546.2 L20.2 U31.16(VDDO)
IO_2V5: C543.2 L19.2 L21.2 L22.2 R340.1 R341.1 U31.3(OE) Y5.1(TRI-STATE) Y5.4(VDD)
IO_3V3: C541.2 C542.2 U29.1(VDD) U29.10(VDD)
CLK_DIFF1_N: R336.1 U29.7(~{DIFF1})
CLK_DIFF1_P: R335.1 U29.6(DIFF1)
CLK_DIFF2_N: R338.1 U29.9(~{DIFF2})
CLK_DIFF2_P: R337.1 U29.8(DIFF2)
CLOCK_I2C_SCL: U30.12(SCL) ; port CLOCK_I2C.SCL
CLOCK_I2C_SDA: U30.19(SDA) ; port CLOCK_I2C.SDA
HPS_CLK1: U31.1(Q) ; port HPS_CLK1
PCIE_REFCLK_QR0_N: R336.2 ; port PCIE_REFCLK.QR0_N
PCIE_REFCLK_QR0_P: R335.2 ; port PCIE_REFCLK.QR0_P
PCIE_REFCLK_SYN_N: R338.2 ; port PCIE_REFCLK_SYN.SYN_N
PCIE_REFCLK_SYN_P: R337.2 ; port PCIE_REFCLK_SYN.SYN_P
REFCLK_SDI_N: C545.1 ; port REFCLK_SDI.SDI_N
REFCLK_SDI_P: C544.1 ; port REFCLK_SDI.SDI_P
NetC532_2: C532.2 C533.2 C534.2 C535.2 C536.2 L19.1 R339.1 U30.7(VDD) U30.15(VDDO2) U30.24(VDD)
NetC544_2: C544.2 U32.4(CLK+)
NetC545_2: C545.2 U32.5(CLK-)
NetC547_2: C547.2 L21.1 U31.12(VDD)
NetJ17_1: J17.1 U31.10(CLK1)
NetJ18_1: J18.1 R340.2 U31.9(SEL0)
NetJ19_1: J19.1 R341.2 U31.7(SEL1)
NetR339_2: R339.2 U30.8(INTR)
NetU29_2: U29.2(XOUT) Y3.3(X2)
NetU29_3: U29.3(XIN/CLKIN) Y3.1(X1)
NetU30_1: U30.1(CLKIN) Y4.1(X1)
NetU30_2: U30.2(CLKINB) Y4.3(X2)
NetU30_14: U30.14(CLK2A) U31.14(CLK0)
NetU31_8: U31.8(CLK2) Y5.3(OUTPUT)

Not connected (* = marked no-connect by the designer): U30 5(FDBK) 9(CLK3B) 10(CLK3A) 13(CLK2B) 17(CLK1B) 18(CLK1A) 21(CLK0B) 22(CLK0A); U31 2(NC) 4(CLK3) 6(NC) 11(NC) 13(NC) 15(NC); U32 1(VC) 2(FS)

### Layout directives
differential pair: CLK_DIFF1_N, CLK_DIFF1_P, CLK_DIFF2_N, CLK_DIFF2_P, PCIE_REFCLK_QR0_N, PCIE_REFCLK_QR0_P, PCIE_REFCLK_SYN_N, PCIE_REFCLK_SYN_P, REFCLK_SDI_N, REFCLK_SDI_P

### Notes on the sheet
- Title
- Size:
- Date:
- B
- Number:
- Time:
- Revision:
- Sheet
- of
- File:

### Library data of the parts
C532-C541 C544-C548 = CMP-1663-00009-2: as C483 on sheet PCIE_Connector; Tolerance: 20%; Mounting Technology: Surface Mount; Max Operating Temperature: 125 degC; ComponentLink2URL: http://www.farnell.com/datasheets/1571323.pdf; ComponentLink1URL: http://www.tdk.com/; RoHSCompliant: true; Packaging: Tape and Reel; ComponentLink2Description: Datasheet; Case Code (Imperial): 0402; DatasheetVersion: 09/2011; ComponentLink1Description: Manufacturer URL; PackageDescription: 2-Pin Surface Mount Device, Body 1 x 0.5 mm; PackageReference: 0402; Min Operating Temperature: -55 degC; Case Code (Metric): 1005; Height: 0.5 mm; Package Quantity: 10000; Width: 0.5 mm; Pins: 2; Voltage Rating (DC): 25 V; PartNumber: C1005X7R1E104M; Mount: Surface Mount; Length: 1 mm
C542 = CMP-1662-00016-2: Chip Capacitor, 2.2 uF, +/- 10%, 10 V, -55 to 85 degC, 0603 (1608 Metric), RoHS, Tape and Reel; Tolerance: 10%; Width: 0.031 inch; DatasheetVersion: 01/2013; Case/Package: 0603; Length: 0.063 inch; PartNumber: GRM188R61A225KE34x; Package Quantity: 10000; Case Code (Imperial): 0603; Packaging: Tape and Reel; PackageDescription: 2-Pin Surface Mount Device, Body 1.6 x 0.8 mm; Case Code (Metric): 1608; ComponentLink1Description: Manufacturer URL; Radiation Hardening: No; Mounting Technology: Surface Mount; Height: 0.8 mm; RoHSCompliant: True; ComponentLink2URL: https://datasheet.ciiva.com/134/grm188r61a225ke34-01-134206.pdf; ComponentLink2Description: Datasheet; Max Operating Temperature: 85 degC; Min Operating Temperature: -55 degC; ComponentLink1URL: http://www.murata.com/
C543 = CMP-2008-04637-4: Chip Capacitor, 10 nF, +/- 10%, 50 V, -55 to 125 degC, 0402 (1005 Metric), RoHS, Tape and Reel; Manufacturer: Basic Passives; Voltage Rating: 50 V; Case\/Package: 0402; Type (Capacitors): X7R; Mounting Technology: Surface Mount; Max Operating Temperature: 125 degC; Height: 0.5 mm; PackageDescription: 2-Pin Surface Mount Device, Body 1 x 0.5 mm; Case Code (Imperial): 0402; Tolerance: 10%; ComponentLink1URL: http://www.murata.com/; RoHSCompliant: true; Width: 0.5 mm; Package Quantity: 10000; Packaging: Tape and Reel; ComponentLink1Description: Manufacturer URL; Min Operating Temperature: -55 degC; PartNumber: GRM155R71H103KA88D; REACH SVHC: No SVHC; Case Code (Metric): 1005; Length: 1 mm; DatasheetVersion: 02/2016; Mount: Surface Mount; Radiation Hardening: No; Lead Pitch: 2mm; Voltage Rating (DC): 50 V; Pins: 2; ComponentLink2URL: http://search.murata.co.jp/Ceramy/image/img/A01X/G101/ENG/GRM155R71H103KA88-01.pdf; ComponentLink2Description: Datasheet; PackageReference: 0402
C549 = CMP-1663-00007-1: Chip Capacitor, 10 uF, +/- 10%, 16 V, -55 to 85 degC, 0805 (2012 Metric), RoHS, Tape and Reel; Type (Capacitors): X5R; Voltage Rating (DC): 16 V; Case\/Package: 0805; Tolerance: 10%; Mounting Technology: Surface Mount; Min Operating Temperature: -55 degC; Length: 2 mm; Case Code (Metric): 2012; PackageReference: 0805; Voltage Rating: 16 V; RoHSCompliant: true; ComponentLink1Description: Manufacturer URL; Width: 1.25 mm; ComponentLink1URL: http://www.tdk.com/; Max Operating Temperature: 85 degC; REACH SVHC: No SVHC; Mount: Surface Mount; ComponentLink2URL: https://product.tdk.com/info/en/catalog/datasheets/mlcc_commercial_general_en.pdf; ComponentLink2Description: Datasheet; Pins: 2; Packaging: Tape and Reel; Height: 0.85 mm; Package Quantity: 1; DatasheetVersion: 03/2015; Case Code (Imperial): 0805; PackageDescription: 2-Pin Surface Mount Device, Body 2 x 1.25 mm
J17 = CMP-1713-00001-1: as J15 on sheet PLL1; ComponentLink2Description: Datasheet; Mounting Technology: Through Hole; ComponentLink1Description: Manufacturer URL; PackageDescription: SMA Connector, Pitch 2.54 mm, 1 Position, Height 9.5 mm, Tail Length 4 mm; PartNumber: LTI-SASF54GT; PackageReference: LTI-SASF54GT; DatasheetVersion: Rev. May-99; ComponentLink2URL: http://rfconnector.com/sheets/SASF54GT.pdf; ComponentLink1URL: http://www.rfconnector.com
J18 J19 = CMP-1712-00002-1: Male Header, Pitch 2.54 mm, 1 x 2 Position, Height 8.54 mm, Tail Length 3 mm, -40 to 105 degC, RoHS, Bulk; Manufacturer: Wuerth Elektronik; DatasheetVersion: Rev. J; ComponentLink1Description: Manufacturer URL; ComponentLink2URL: http://katalog.we-online.de/em/datasheet/6130xx11121.pdf; PackageReference: 61300211121; ComponentLink2Description: Datasheet; Mounting Technology: Through Hole; PackageDescription: Male Header, Pitch 2.54 mm, 1 x 2 Position, Height 8.54 mm, Tail Length 3 mm; ComponentLink1URL: https://www.we-online.com/; PartNumber: 613 002 111 21
L19-L21 = CMP-0220-00137-1: SMD EMI Suppression Ferrite Bead WE-CBF, Z = 220 Ohm; Impedance: 220 Ohm; ComponentLink2URL: http://www.we-online.de/katalog/media/pdf/742792780.pdf; ComponentLink1URL: http://www.we-online.com; ComponentLink2Description: Datasheet; PackageDescription: Chip Inductor, 2-Leads, Body 1.0 x 0.5 mm; ComponentLink1Description: Manufacturer Link; PackageReference: SMD-0402; DatasheetVersion: ver 4, Jul-2009; PackageVersion: 2009
L22 = CMP-1662-00018-3: as L18 on sheet PLL1; DatasheetVersion: 03/2011; ComponentLink2URL: https://datasheet.ciiva.com/11800/0900766b811b5866-11800858.pdf; PackageDescription: 2-Pin Surface Mount Device, Body 1 x 0.5 mm; Mounting Technology: Surface Mount; PartNumber: BLM15AG221SN1x; ComponentLink2Description: Datasheet; ComponentLink1Description: Manufacturer URL; ComponentLink1URL: http://www.murata.com/; Max Operating Temperature: 125 degC; Length: 1 mm; Width: 0.5 mm; REACH SVHC: No SVHC; Height: 0.5 mm; Case/Package: 0402; Min Operating Temperature: -55 degC; RoHSCompliant: True; Radiation Hardening: No; Package Quantity: 10000; Case Code (Imperial): 0402; Case Code (Metric): 1005
R335-R338 = CMP-2002-00429-3: Chip Resistor, 0 mOhm, +/- 5%, 100 mW, -55 to 155 degC, 0402 (1005 Metric), RoHS, Tape and Reel; Manufacturer: Basic Passives; Power Rating: 100 mW; Voltage Rating: 50 V; Case\/Package: 0402; Max Operating Temperature: 155 degC; Tolerance: 5%; PartNumber: ERJ-2GE0R00X; Case Code (Imperial): 0402; Package Quantity: 10000; Length: 1 mm; Mounting Technology: Surface Mount; ComponentLink1URL: http://www.panasonic.com/; Height: 0.35 mm; Width: 0.5 mm; Min Operating Temperature: -55 degC; Case Code (Metric): 1005; RoHSCompliant: true; REACH SVHC: Unknown; ComponentLink1Description: Manufacturer URL; Packaging: Tape and Reel; Mount: Surface Mount; PackageDescription: 2-Pin Surface Mount Device, Body 1 x 0.5 mm; PackageReference: 0402; ComponentLink2URL: http://industrial.panasonic.com/cdbs/www-data/pdf/RDA0000/AOA0000C84.pdf; DatasheetVersion: 03/2015; Radiation Hardening: No; Pins: 2; ComponentLink2Description: Datasheet
R339-R341 = CMP-2002-00606-3: Chip Resistor, 1 KOhm, +/- 1%, 100 mW, -55 to 155 degC, 0402 (1005 Metric), RoHS, Tape and Reel; Manufacturer: Basic Passives; Voltage Rating: 50 V; Power Rating: 100 mW; Case\/Package: 0402; PartNumber: ERJ-2RKF1001X; Width: 0.5 mm; ComponentLink1URL: http://www.panasonic.com/; Length: 1 mm; Min Operating Temperature: -55 degC; PackageDescription: 2-Pin Surface Mount Device, Body 1 x 0.5 mm; Case Code (Metric): 1005; Height: 0.35 mm; ComponentLink1Description: Manufacturer URL; Mounting Technology: Surface Mount; Tolerance: 1%; Packaging: Tape and Reel; Package Quantity: 10000; REACH SVHC: Yes; Max Operating Temperature: 155 degC; Mount: Surface Mount; RoHSCompliant: true; Case Code (Imperial): 0402; DatasheetVersion: 04/2015; Radiation Hardening: No; Pins: 2; ComponentLink2Description: Datasheet; PackageReference: 0402; ComponentLink2URL: http://industrial.panasonic.com/cdbs/www-data/pdf/RDA0000/AOA0000C86.pdf
U29 = CMP-1706-00007-1: PCI-Express Gen 1 Dual Output Clock Generator, 3.13 to 3.46 V, -40 to 85 degC, 10-Pin TDFN, RoHS, Tube; Manufacturer: Silicon Labs; PartNumber: Si52112-A1-GM2; ComponentLink1URL: http://www.silabs.com/; PackageReference: TDFN-10; DatasheetVersion: Rev. 1.2; PackageDescription: 10-Pin Small Outline Non-Lead, Body 3.00 x 3.00 mm, Pitch 0.50 mm; ComponentLink2URL: http://www.silabs.com/Support%20Documents/TechnicalDocs/Si52112-A1-A2.pdf; Code_IPC: J-STD-020; ComponentLink2Description: Datasheet; Mounting Technology: Surface Mount; Code_JEDEC: MO-229; ComponentLink1Description: Manufacturer URL
U30 = CMP-1706-00005-1: I2C-Programmable Any-Frequency, Any-Output Quad Clock Generator, 1.8 / 2.5 / 3.3 V, 0.16 to 200 MHz Output, -40 to 85 degC, 24-Pin QFN, RoHS; Manufacturer: Silicon Labs; ComponentLink2Description: Datasheet; Code_IPC: J-STD-020; DatasheetVersion: Rev. 1.6; PartNumber: Si5338C-B03798-GM; Mounting Technology: Surface Mount; PackageDescription: 24-Pin Quad Flat No-lead Package, Body 4 x 4 mm, Pitch 0.5 mm; ComponentLink1Description: Manufacturer URL; ComponentLink2URL: https://www.silabs.com/Support%20Documents/TechnicalDocs/Si5338.pdf; PackageReference: QFN-24; ComponentLink1URL: http://www.silabs.com/; PartId: 1
U31 = CMP-1699-00001-1: Single-Ended Multiplexer, 2.375 to 3.465 V, -40 to 85 degC, 16-Pin TSSOP, RoHS, Tube; Manufacturer: IDT; PackageReference: TSSOP-16; PackageDescription: 16-Pin Thin Shrink Small Outline Package, Body 5 x 4.4 mm, Pitch 0.65 mm; PartNumber: ICS83054AGILF; ComponentLink1URL: http://www.idt.com/; ComponentLink2URL: https://datasheet.ciiva.com/6676/idt-83054i-dst-20091106-6676576.pdf; Mounting Technology: Surface Mount; ComponentLink2Description: Datasheet; ComponentLink1Description: Manufacturer URL; DatasheetVersion: Rev. C
U32 = CMP-1706-00001-1: Dual Frequency Voltage-Controlled Crystal Oscillator (VCXO), LVDS, 2.5 V, 100 KHz to 250 MHz, -40 to 85 degC, 6-Pin DFN, RoHS, Tray; Manufacturer: Silicon Labs; ComponentLink2URL: http://www.silabs.com/Support%20Documents/TechnicalDocs/Si516.pdf; Mounting Technology: Surface Mount; PackageDescription: 6-Pin Small Outline No-lead, Body 5 x 7 mm, Pitch 2.54 mm; ComponentLink2Description: Datasheet; PartNumber: 516FHA000132AAG; PackageReference: DFN-6; ComponentLink1URL: http://www.silabs.com/; ComponentLink1Description: Manufacturer URL; DatasheetVersion: Rev. 1.0
Y3 Y4 = CMP-1695-00001-3: as Y1 on sheet PLL1; ComponentLink2Description: Datasheet; Mounting Technology: Surface Mount; PackageDescription: 4-Pin Surface Mount Device, Body 1.6 x 2 mm, Pitch 1.45 mm; ComponentLink1URL: https://www.eea.epson.com/; DatasheetVersion: Rev. Feb-15; ComponentLink2URL: https://support.epson.biz/td/api/doc_check.php?dl=brief_FA-128_en.pdf; ComponentLink1Description: Manufacturer URL; PartNumber: FA-128 25.0000MB-C
Y5 = CMP-1688-00001-1: CMOS Compatible SMD Crystal Oscillator, 33 MHz, 2.5 V, -20 to 70 degC, 4-Pin SMD, RoHS, Tape and Reel; Manufacturer: Abracon; Mounting Technology: Surface Mount; ComponentLink1Description: Manufacturer URL; PackageReference: ASE2; PartNumber: ASE2-33.000MHZ-ET; PackageDescription: 4-Pin Surface Mount Device, Body 3.2 x 2.5 mm, Pitch 2.1 mm; DatasheetVersion: Rev. Aug-14; ComponentLink2URL: http://www.abracon.com/Oscillators/ASE2series.pdf; ComponentLink2Description: Datasheet; ComponentLink1URL: http://www.abracon.com/

## Sheet Power.SchDoc: POWER BOARD
size C; DocumentNumber: 32; SheetNumber: 32; SheetTotal: 46
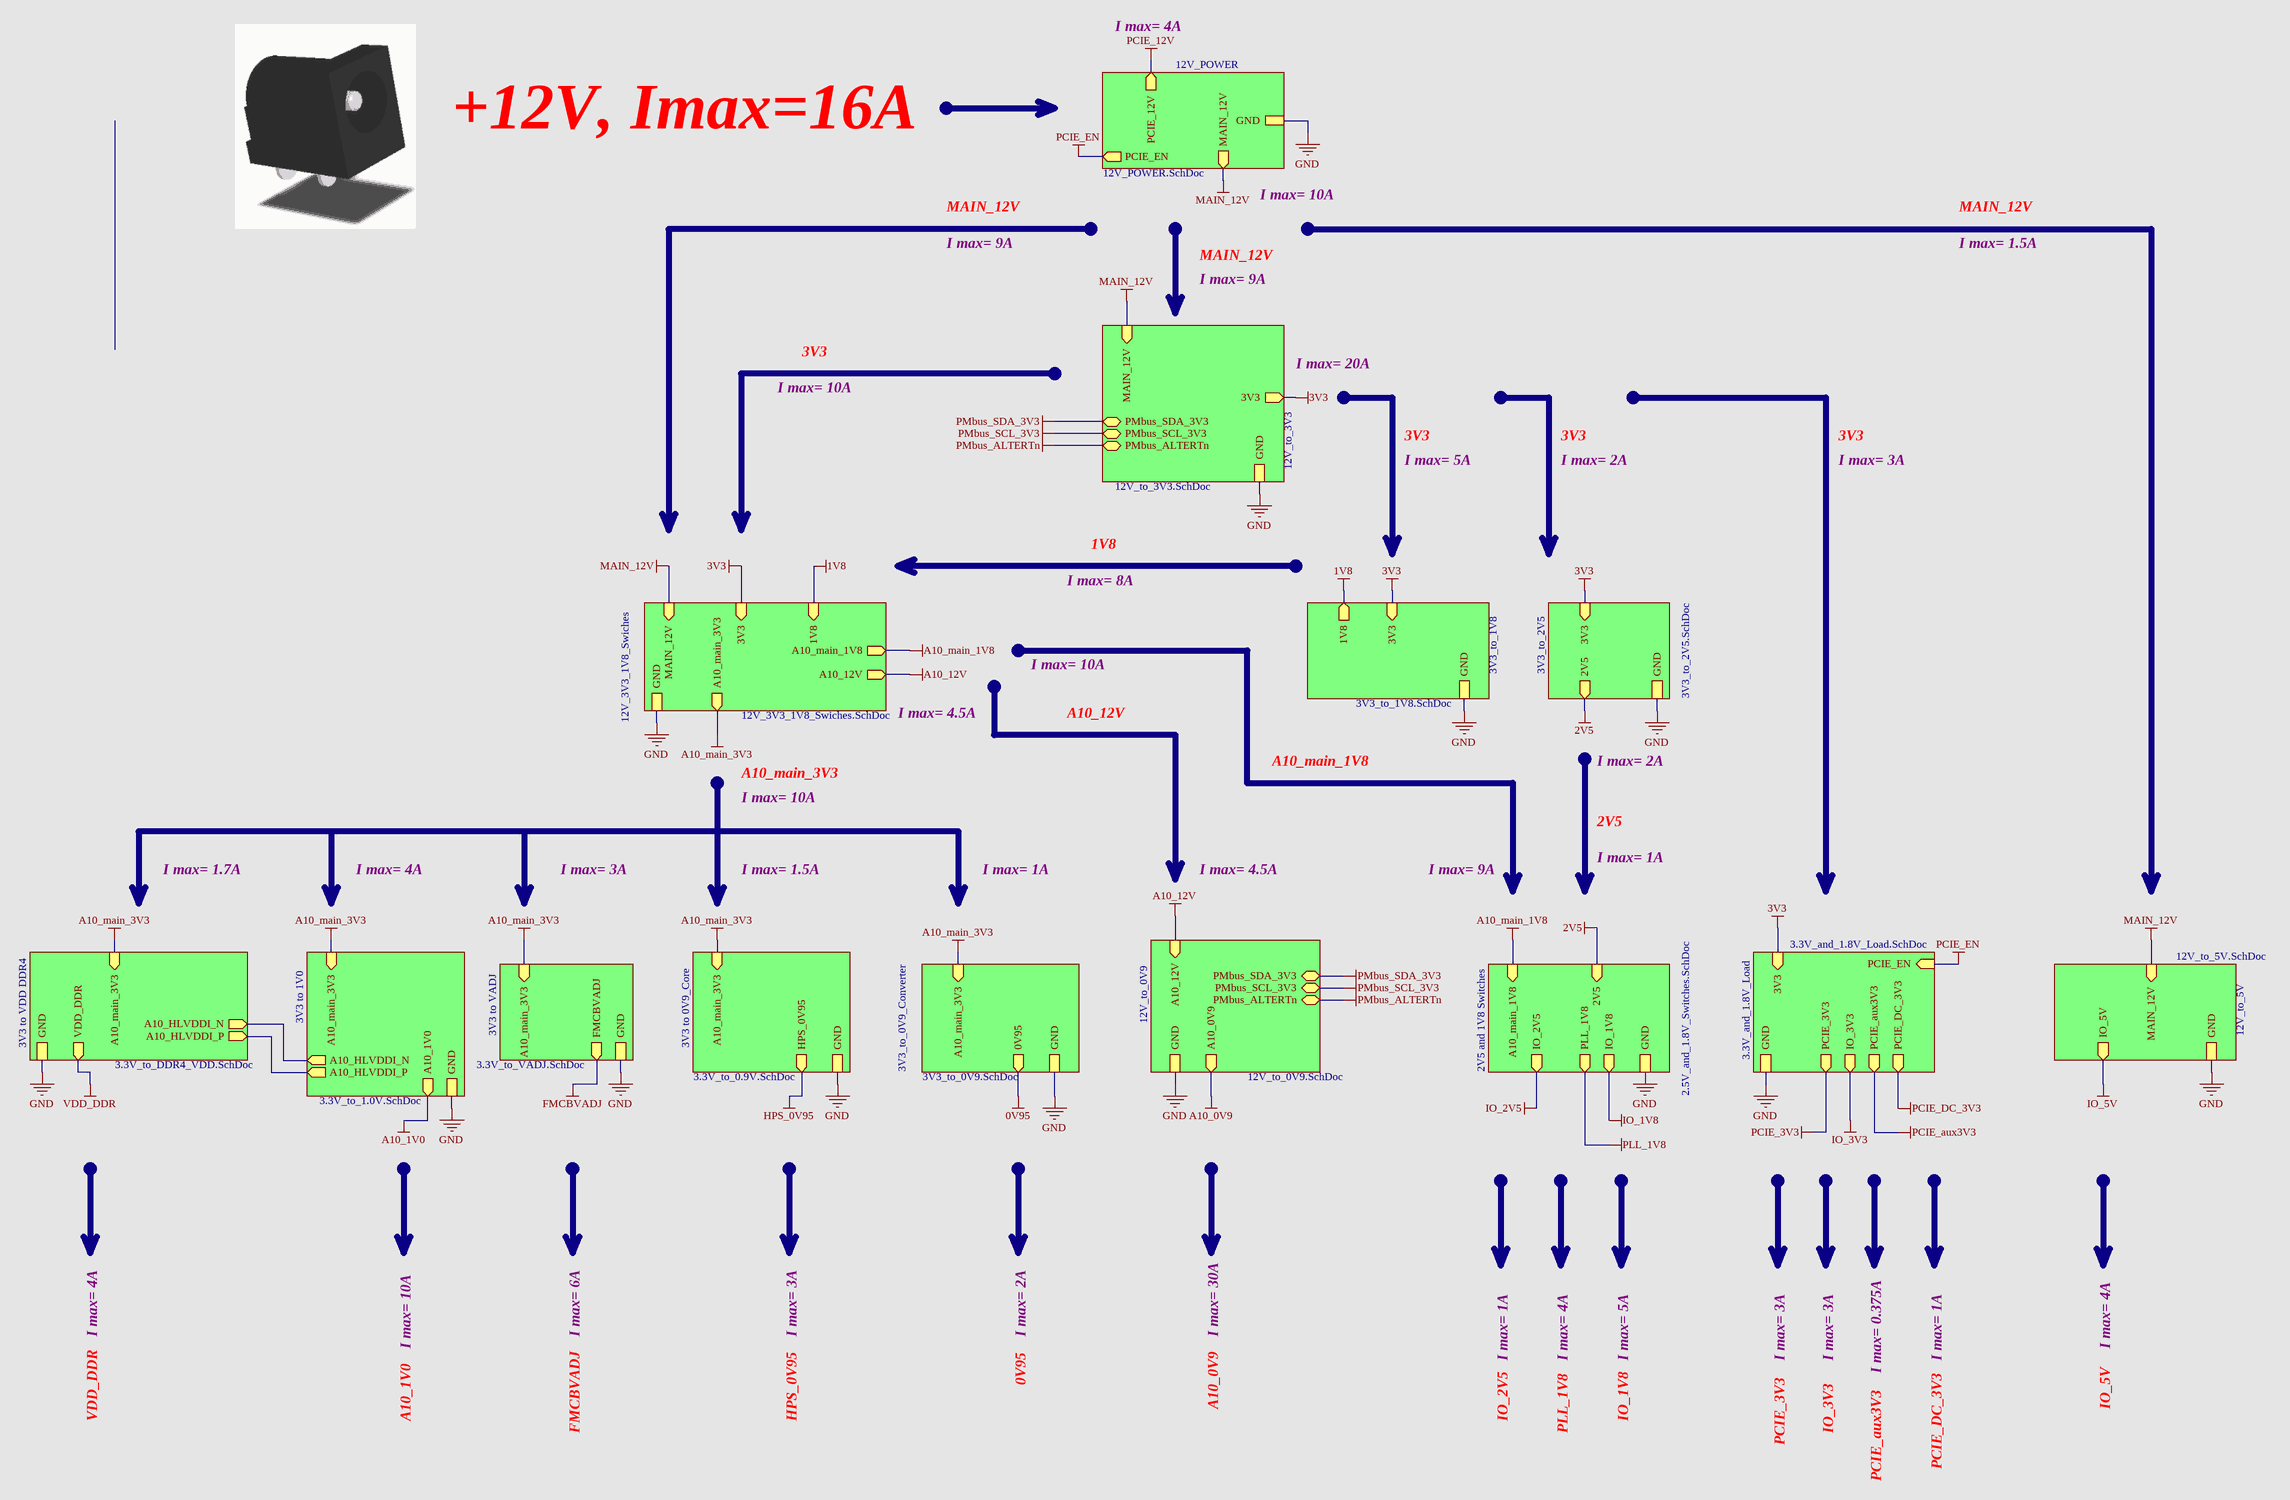
[diagram p21: Power.SchDoc]

### Sub-sheets
2V5 and 1V8 Switches = 2.5V_and_1.8V_Switches.SchDoc: 2V5 (in), IO_2V5 (out), A10_main_1V8 (in), PLL_1V8 (out), IO_1V8 (out), GND
3.3V_and_1.8V_Load = 3.3V_and_1.8V_Load.SchDoc: PCIE_EN (in), 3V3 (in), PCIE_3V3 (out), IO_3V3 (out), PCIE_aux3V3 (out), PCIE_DC_3V3 (out), GND
3V3 to 0V9_Core = 3.3V_to_0.9V.SchDoc (file not in this document): A10_main_3V3 (in), HPS_0V95 (out), GND
3V3 to 1V0 = 3.3V_to_1.0V.SchDoc (file not in this document): A10_HLVDDI_P (out), A10_HLVDDI_N (out), A10_main_3V3 (in), A10_1V0 (out), GND
3V3 to VADJ = 3.3V_to_VADJ.SchDoc (file not in this document): A10_main_3V3 (in), FMCBVADJ (out), GND
3V3 to VDD DDR4 = 3.3V_to_DDR4_VDD.SchDoc (file not in this document): A10_HLVDDI_P (out), A10_HLVDDI_N (out), A10_main_3V3 (in), VDD_DDR (out), GND
3V3_to_0V9_Converter = 3V3_to_0V9.SchDoc (file not in this document): A10_main_3V3 (in), 0V95 (out), GND
3V3_to_1V8 = 3V3_to_1V8.SchDoc (file not in this document): 1V8 (out), 3V3 (in), GND
3V3_to_2V5 = 3V3_to_2V5.SchDoc (file not in this document): 3V3 (in), 2V5 (out), GND
12V_3V3_1V8_Swiches = 12V_3V3_1V8_Swiches.SchDoc: MAIN_12V (in), A10_12V (out), 3V3 (in), A10_main_3V3 (out), 1V8 (in), A10_main_1V8 (out), GND
12V_POWER = 12V_POWER.SchDoc: PCIE_EN (out), MAIN_12V (out), PCIE_12V (out), GND
12V_to_0V9 = 12V_to_0V9.SchDoc: PMbus_SDA_3V3 (bidir), PMbus_SCL_3V3 (bidir), PMbus_ALTERTn (bidir), A10_12V (in), A10_0V9 (out), GND
12V_to_3V3 = 12V_to_3V3.SchDoc: PMbus_SDA_3V3 (bidir), PMbus_SCL_3V3 (bidir), PMbus_ALTERTn (bidir), MAIN_12V (in), 3V3 (out), GND
12V_to_5V = 12V_to_5V.SchDoc: IO_5V (out), MAIN_12V (in), GND

### Nets
0V95: sheet 3V3_to_0V9_Converter/0V95
1V8: sheet 12V_3V3_1V8_Swiches/1V8, sheet 3V3_to_1V8/1V8
2V5: sheet 3V3_to_2V5/2V5, sheet 2V5 and 1V8 Switches/2V5
3V3: sheet 12V_3V3_1V8_Swiches/3V3, sheet 12V_to_3V3/3V3, sheet 3V3_to_2V5/3V3, sheet 3V3_to_1V8/3V3, sheet 3.3V_and_1.8V_Load/3V3
A10_1V0: sheet 3V3 to 1V0/A10_1V0
A10_12V: sheet 12V_3V3_1V8_Swiches/A10_12V, sheet 12V_to_0V9/A10_12V
A10_main_1V8: sheet 12V_3V3_1V8_Swiches/A10_main_1V8, sheet 2V5 and 1V8 Switches/A10_main_1V8
A10_main_3V3: sheet 12V_3V3_1V8_Swiches/A10_main_3V3, sheet 3V3 to 0V9_Core/A10_main_3V3, sheet 3V3 to 1V0/A10_main_3V3, sheet 3V3 to VDD DDR4/A10_main_3V3, sheet 3V3 to VADJ/A10_main_3V3, sheet 3V3_to_0V9_Converter/A10_main_3V3
FMCBVADJ: sheet 3V3 to VADJ/FMCBVADJ
GND: sheet 12V_POWER/GND, sheet 12V_3V3_1V8_Swiches/GND, sheet 12V_to_0V9/GND, sheet 12V_to_3V3/GND, sheet 12V_to_5V/GND, sheet 3V3 to 0V9_Core/GND, sheet 3V3 to 1V0/GND, sheet 3V3 to VDD DDR4/GND, sheet 3V3 to VADJ/GND, sheet 3V3_to_0V9_Converter/GND, sheet 3V3_to_2V5/GND, sheet 3V3_to_1V8/GND, sheet 2V5 and 1V8 Switches/GND, sheet 3.3V_and_1.8V_Load/GND
HPS_0V95: sheet 3V3 to 0V9_Core/HPS_0V95
MAIN_12V: sheet 12V_POWER/MAIN_12V, sheet 12V_3V3_1V8_Swiches/MAIN_12V, sheet 12V_to_3V3/MAIN_12V, sheet 12V_to_5V/MAIN_12V
PCIE_EN: sheet 12V_POWER/PCIE_EN, sheet 3.3V_and_1.8V_Load/PCIE_EN
PMbus_ALTERTn: sheet 12V_to_0V9/PMbus_ALTERTn, sheet 12V_to_3V3/PMbus_ALTERTn
PMbus_SCL_3V3: sheet 12V_to_0V9/PMbus_SCL_3V3, sheet 12V_to_3V3/PMbus_SCL_3V3
PMbus_SDA_3V3: sheet 12V_to_0V9/PMbus_SDA_3V3, sheet 12V_to_3V3/PMbus_SDA_3V3
(unnamed): sheet 3V3 to 1V0/A10_HLVDDI_P, sheet 3V3 to VDD DDR4/A10_HLVDDI_P
(unnamed): sheet 3V3 to 1V0/A10_HLVDDI_N, sheet 3V3 to VDD DDR4/A10_HLVDDI_N

### Notes on the sheet
- I max= 4A
- +12V, Imax=16A
- I max= 10A
- MAIN_12V
- I max= 9A
- I max= 1.5A
- 3V3
- I max= 20A
- I max= 5A
- I max= 2A
- I max= 3A
- 1V8
- I max= 8A
- I max= 4.5A
- A10_12V
- A10_main_3V3
- A10_main_1V8
- I max= 1A
- 2V5
- I max= 1.7A
- I max= 6A
- I max= 30A
- 0V95
- A10_0V9
- I max= 0.375A
- IO_5V
- VDD_DDR
- A10_1V0
- FMCBVADJ
- HPS_0V95
- IO_2V5
- PLL_1V8
- IO_1V8
- PCIE_3V3
- IO_3V3
- PCIE_DC_3V3
- PCIE_aux3V3
- Title
- Size:
- Date:
- File:
- C
- Number:
- Time:
- Revision:
- Sheet
- of